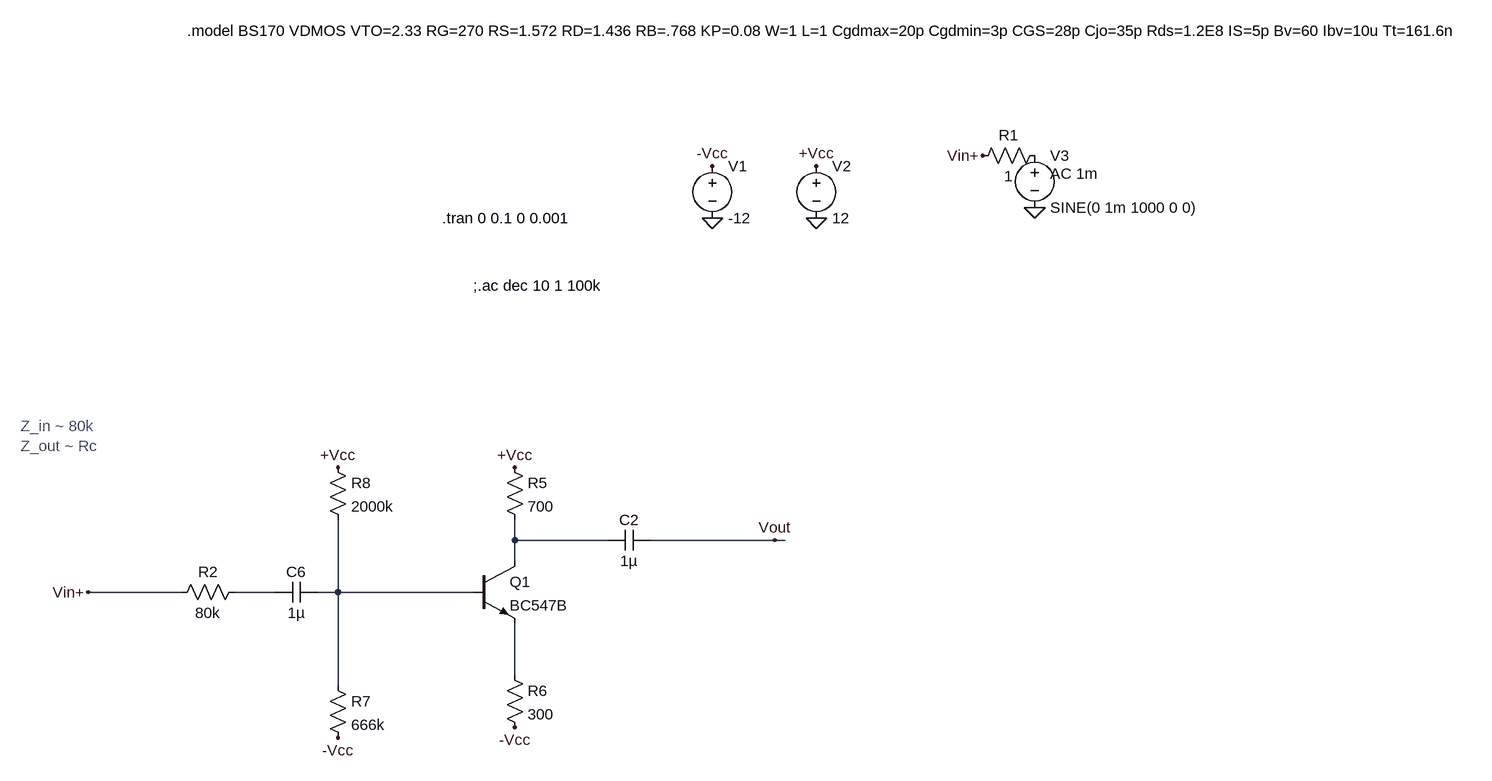
[diagram p0: schematic Draft1.asc]
Draft1.asc, the LTspice schematic file:
Version 4
SHEET 1 2532 912
WIRE -464 304 -464 272
WIRE -320 304 -464 304
WIRE -64 304 -256 304
WIRE -48 304 -64 304
WIRE -464 336 -464 304
WIRE -976 384 -1120 384
WIRE -832 384 -896 384
WIRE -736 384 -736 272
WIRE -736 384 -768 384
WIRE -528 384 -736 384
WIRE -464 512 -464 432
WIRE -736 528 -736 384
FLAG -160 -192 0
FLAG 0 -192 0
FLAG -160 -272 -Vcc
FLAG 0 -272 +Vcc
FLAG 336 -208 0
FLAG 256 -288 Vin+
FLAG -736 192 +Vcc
FLAG -464 192 +Vcc
FLAG -736 608 -Vcc
FLAG -464 592 -Vcc
FLAG -64 304 Vout
FLAG -1120 384 Vin+
SYMBOL voltage -160 -288 R0
WINDOW 123 0 0 Left 0
WINDOW 39 0 0 Left 0
SYMATTR InstName V1
SYMATTR Value -12
SYMBOL voltage 0 -288 R0
WINDOW 123 0 0 Left 0
WINDOW 39 0 0 Left 0
SYMATTR InstName V2
SYMATTR Value 12
SYMBOL voltage 336 -304 R0
WINDOW 123 24 44 Left 2
WINDOW 39 0 0 Left 0
SYMATTR Value2 AC 1m
SYMATTR InstName V3
SYMATTR Value SINE(0 1m 1000 0 0)
SYMBOL res 352 -304 R90
WINDOW 0 0 56 VBottom 2
WINDOW 3 32 56 VTop 2
SYMATTR InstName R1
SYMATTR Value 1
SYMBOL npn -528 336 R0
SYMATTR InstName Q1
SYMATTR Value BC547B
SYMBOL res -480 176 R0
SYMATTR InstName R5
SYMATTR Value 700
SYMBOL res -480 496 R0
SYMATTR InstName R6
SYMATTR Value 300
SYMBOL res -752 512 R0
SYMATTR InstName R7
SYMATTR Value 666k
SYMBOL res -752 176 R0
SYMATTR InstName R8
SYMATTR Value 2000k
SYMBOL cap -256 288 R90
WINDOW 0 0 32 VBottom 2
WINDOW 3 32 32 VTop 2
SYMATTR InstName C2
SYMATTR Value 1µ
SYMBOL cap -768 368 R90
WINDOW 0 0 32 VBottom 2
WINDOW 3 32 32 VTop 2
SYMATTR InstName C6
SYMATTR Value 1µ
SYMBOL res -880 368 R90
WINDOW 0 0 56 VBottom 2
WINDOW 3 32 56 VTop 2
SYMATTR InstName R2
SYMATTR Value 80k
TEXT -576 -192 Left 2 !.tran 0 0.1 0 0.001
TEXT -968 -480 Left 2 !.model BS170 VDMOS VTO=2.33 RG=270 RS=1.572 RD=1.436 RB=.768 KP=0.08 W=1 L=1 Cgdmax=20p Cgdmin=3p CGS=28p Cjo=35p Rds=1.2E8 IS=5p Bv=60 Ibv=10u Tt=161.6n
TEXT -528 -88 Left 2 !;.ac dec 10 1 100k
TEXT -1224 128 Left 2 ;Z_in ~ 80k\nZ_out ~ Rc

The netlist it stands for:
* Draft1.asc
V1 -Vcc 0 -12
V2 +Vcc 0 12
V3 P001 0 SINE(0 1m 1000 0 0) AC 1m
R1 P001 Vin+ 1
Q1 N001 N003 N004 0 BC547B
R5 +Vcc N001 700
R6 N004 -Vcc 300
R7 N003 -Vcc 666k
R8 +Vcc N003 2000k
C2 Vout N001 1µ
C6 N003 N002 1µ
R2 N002 Vin+ 80k
.model NPN NPN
.model PNP PNP
.lib standard.bjt
.tran 0 0.1 0 0.001
.model BS170 VDMOS VTO=2.33 RG=270 RS=1.572 RD=1.436 RB=.768 KP=0.08 W=1 L=1 Cgdmax=20p Cgdmin=3p CGS=28p Cjo=35p Rds=1.2E8 IS=5p Bv=60 Ibv=10u Tt=161.6n
;.ac dec 10 1 100k
* Z_in ~ 80k
* Z_out ~ Rc
.backanno
.end

* Results of the author's LTspice run, read from the files saved beside the schematic
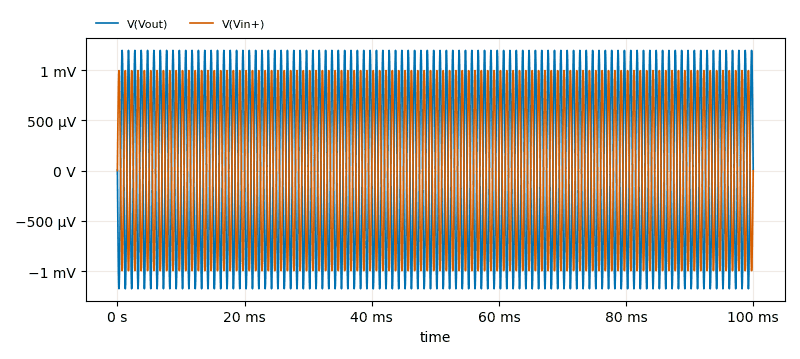
[diagram p1: Transient Analysis of Draft1.asc, plotted from the saved traces]
* Transient Analysis, 1 run:
*   V(Vout): min -1.177 mV, max 1.199 mV, average 10.59 µV, rms 839.6 µV, last 11.32 µV
*   V(Vin+): min -996.8 µV, max 996.8 µV, average -7.114 nV, rms 704.6 µV, last 0 V